# Altium schematic sheet 05-ORStatusLed.SchDoc
size A4
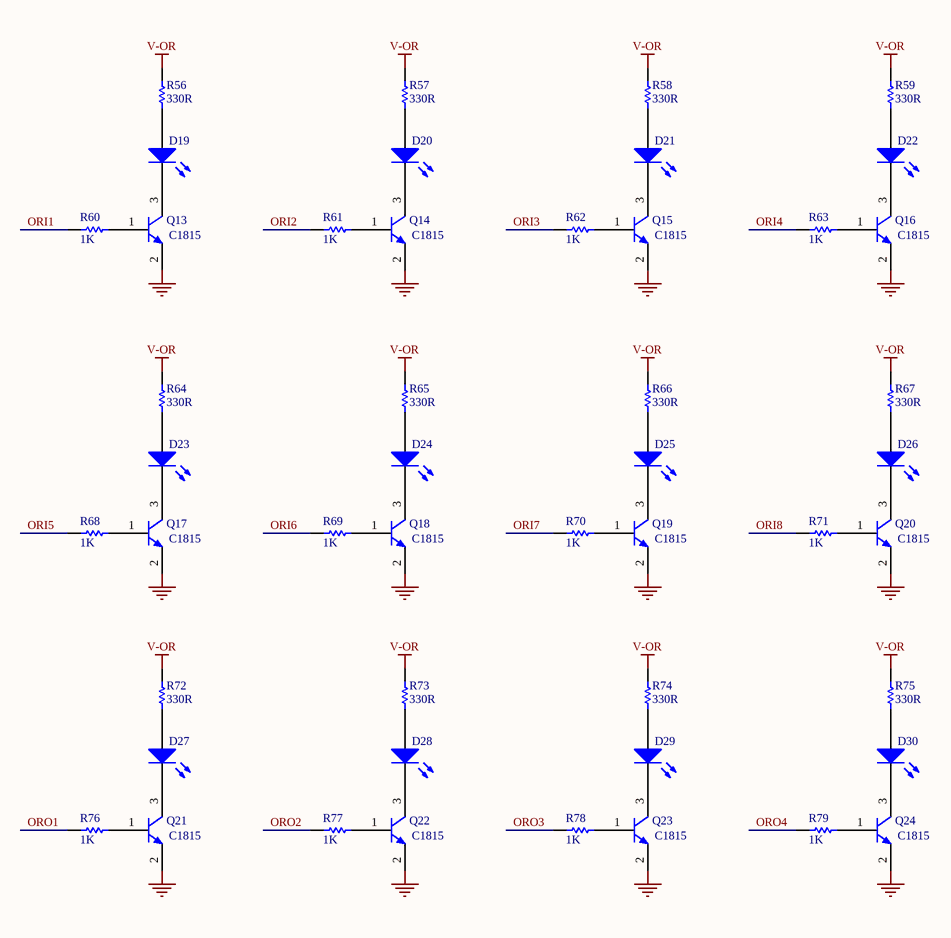
[diagram p0: 05-ORStatusLed.SchDoc]

## Parts
D19  LED  [LED-3528]  (value not drawn)
D20  LED  [LED-3528]  (value not drawn)
D21  LED  [LED-3528]  (value not drawn)
D22  LED  [LED-3528]  (value not drawn)
D23  LED  [LED-3528]  (value not drawn)
D24  LED  [LED-3528]  (value not drawn)
D25  LED  [LED-3528]  (value not drawn)
D26  LED  [LED-3528]  (value not drawn)
D27  LED  [LED-3528]  (value not drawn)
D28  LED  [LED-3528]  (value not drawn)
D29  LED  [LED-3528]  (value not drawn)
D30  LED  [LED-3528]  (value not drawn)
Q13  value C1815  [SOT23-321]  (hidden comment: C1815-SMD)
Q14  value C1815  [SOT23-321]  (hidden comment: C1815-SMD)
Q15  value C1815  [SOT23-321]  (hidden comment: C1815-SMD)
Q16  value C1815  [SOT23-321]  (hidden comment: C1815-SMD)
Q17  value C1815  [SOT23-321]  (hidden comment: C1815-SMD)
Q18  value C1815  [SOT23-321]  (hidden comment: C1815-SMD)
Q19  value C1815  [SOT23-321]  (hidden comment: C1815-SMD)
Q20  value C1815  [SOT23-321]  (hidden comment: C1815-SMD)
Q21  value C1815  [SOT23-321]  (hidden comment: C1815-SMD)
Q22  value C1815  [SOT23-321]  (hidden comment: C1815-SMD)
Q23  value C1815  [SOT23-321]  (hidden comment: C1815-SMD)
Q24  value C1815  [SOT23-321]  (hidden comment: C1815-SMD)
R56  330R  [R-0805]
R57  330R  [R-0805]
R58  330R  [R-0805]
R59  330R  [R-0805]
R60  1K  [R-0805]
R61  1K  [R-0805]
R62  1K  [R-0805]
R63  1K  [R-0805]
R64  330R  [R-0805]
R65  330R  [R-0805]
R66  330R  [R-0805]
R67  330R  [R-0805]
R68  1K  [R-0805]
R69  1K  [R-0805]
R70  1K  [R-0805]
R71  1K  [R-0805]
R72  330R  [R-0805]
R73  330R  [R-0805]
R74  330R  [R-0805]
R75  330R  [R-0805]
R76  1K  [R-0805]
R77  1K  [R-0805]
R78  1K  [R-0805]
R79  1K  [R-0805]

## Nets
GND: Q13.2(E) Q14.2(E) Q15.2(E) Q16.2(E) Q17.2(E) Q18.2(E) Q19.2(E) Q20.2(E) Q21.2(E) Q22.2(E) Q23.2(E) Q24.2(E)
V-OR: R56.2 R57.2 R58.2 R59.2 R64.2 R65.2 R66.2 R67.2 R72.2 R73.2 R74.2 R75.2
ORI1: R60.2
ORI2: R61.2
ORI3: R62.2
ORI4: R63.2
ORI5: R68.2
ORI6: R69.2
ORI7: R70.2
ORI8: R71.2
ORO1: R76.2
ORO2: R77.2
ORO3: R78.2
ORO4: R79.2
NetD19_1: D19.1(A) R56.1
NetD19_2: D19.2(K) Q13.3(C)
NetD20_1: D20.1(A) R57.1
NetD20_2: D20.2(K) Q14.3(C)
NetD21_1: D21.1(A) R58.1
NetD21_2: D21.2(K) Q15.3(C)
NetD22_1: D22.1(A) R59.1
NetD22_2: D22.2(K) Q16.3(C)
NetD23_1: D23.1(A) R64.1
NetD23_2: D23.2(K) Q17.3(C)
NetD24_1: D24.1(A) R65.1
NetD24_2: D24.2(K) Q18.3(C)
NetD25_1: D25.1(A) R66.1
NetD25_2: D25.2(K) Q19.3(C)
NetD26_1: D26.1(A) R67.1
NetD26_2: D26.2(K) Q20.3(C)
NetD27_1: D27.1(A) R72.1
NetD27_2: D27.2(K) Q21.3(C)
NetD28_1: D28.1(A) R73.1
NetD28_2: D28.2(K) Q22.3(C)
NetD29_1: D29.1(A) R74.1
NetD29_2: D29.2(K) Q23.3(C)
NetD30_1: D30.1(A) R75.1
NetD30_2: D30.2(K) Q24.3(C)
NetQ13_1: Q13.1(B) R60.1
NetQ14_1: Q14.1(B) R61.1
NetQ15_1: Q15.1(B) R62.1
NetQ16_1: Q16.1(B) R63.1
NetQ17_1: Q17.1(B) R68.1
NetQ18_1: Q18.1(B) R69.1
NetQ19_1: Q19.1(B) R70.1
NetQ20_1: Q20.1(B) R71.1
NetQ21_1: Q21.1(B) R76.1
NetQ22_1: Q22.1(B) R77.1
NetQ23_1: Q23.1(B) R78.1
NetQ24_1: Q24.1(B) R79.1

## Library data of the parts
D19-D30 = LED2: Typical RED, GREEN, YELLOW, AMBER GaAs LED; Published: 8-Jun-2000; LatestRevisionDate: 17-Jul-2002; LatestRevisionNote: Re-released for DXP Platform.; PackageVersion: Feb-2002; PackageReference: 3.2X1.6X1.1; Publisher: Altium Limited; PackageDescription: SM LED; 2 Flat Leads
Q13-Q24 = NPN: NPN Bipolar Transistor; Published: 8-Jun-2000; LatestRevisionDate: 17-Jul-2002; LatestRevisionNote: Re-released for DXP Platform.; PackageReference: TO-226-AA; PackageDescription: TO, Flat Index; 3 In-Line, Axial Leads; Body Dia. 4.8mm; Leads 0.55 x 0.51 mm (max); Code_JEDEC: TO-226-AA
R56-R79 = Res1: Resistor; Published: 8-Jun-2000; LatestRevisionDate: 17-Jul-2002; LatestRevisionNote: Re-released for DXP Platform.; PackageReference: AXIAL-0.3; Publisher: Altium Limited; PackageDescription: Axial Device, Thru-Hole; 2 Leads; 0.3 in Pin Spacing
  R56-R59 R64-R67 R72-R75: Value: 330R
  R60-R63 R68-R71 R76-R79: Value: 1K